# EAGLE schematic Simon (EAGLE 7.6.0)
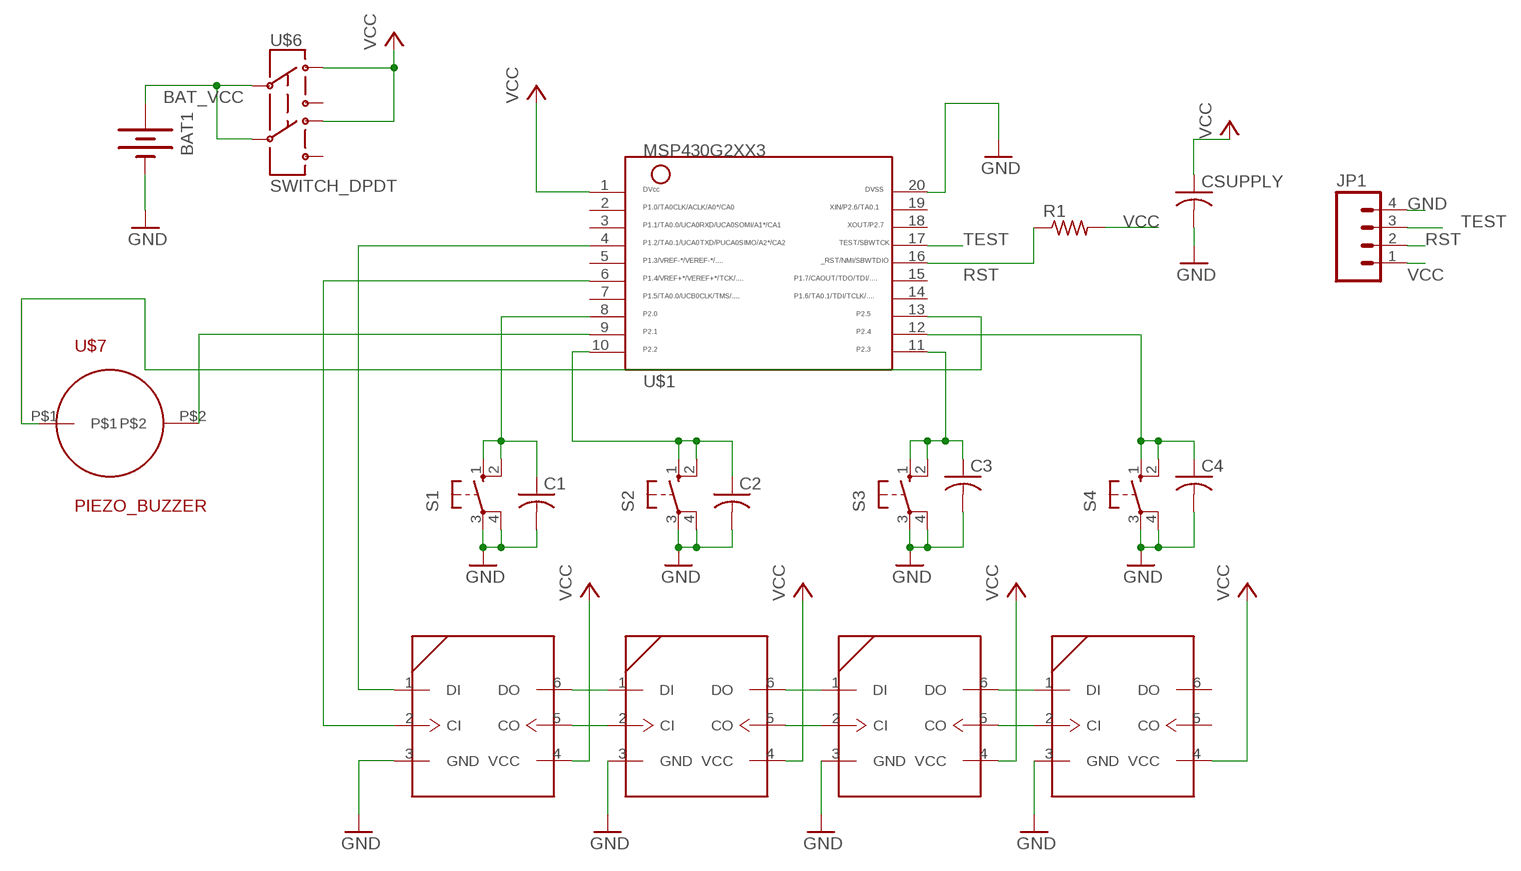
[diagram p0: schematic, sheet 1]

## Parts
BAT1  BATTERY  [BATTERY_PACK_2AA]
C1  C-USC1206  [C1206]
C2  C-USC1206  [C1206]
C3  C-USC1206  [C1206]
C4  C-USC1206  [C1206]
CSUPPLY  C-USC1206  [C1206]
JP1  M04LOCK  [1X04_LOCK]
LED1  APA102  [5050]
LED2  APA102  [5050]
LED3  APA102  [5050]
LED4  APA102  [5050]
R1  R-US_R1206  [R1206]
S1  10-XX  [B3F-10XX]
S2  10-XX  [B3F-10XX]
S3  10-XX  [B3F-10XX]
S4  10-XX  [B3F-10XX]
U$1  MSP430G2XX3TSSOP  [PW20]
U$6  SWITCH_DPDT  [JS_DPDT_TH]
U$7  PIEZO_BUZZER  [PIEZO_BUZZER]

## Nets
BAT_VCC: BAT1.3V(+) U$6.2 U$6.5
GND: BAT1.GND(-) C1.2 C2.2 C3.2 C4.2 CSUPPLY.2 JP1.4 LED1.3(GND) LED2.3(GND) LED3.3(GND) LED4.3(GND) S1.3(P) S1.4(P1) S2.3(P) S2.4(P1) S3.3(P) S3.4(P1) S4.3(P) S4.4(P1) U$1.20
N$1: LED1.6(DO) LED2.1(DI)
N$2: LED1.5(CO) LED2.2(CI)
N$3: LED2.6(DO) LED3.1(DI)
N$4: LED2.5(CO) LED3.2(CI)
N$5: LED3.6(DO) LED4.1(DI)
N$6: LED3.5(CO) LED4.2(CI)
N$7: LED1.1(DI) U$1.4
N$8: LED1.2(CI) U$1.6
N$10: U$1.9 U$7.P$2
N$11: U$1.13 U$7.P$1
N$13: C1.1 S1.1(S) S1.2(S1) U$1.8
N$14: C2.1 S2.1(S) S2.2(S1) U$1.10
N$15: C3.1 S3.1(S) S3.2(S1) U$1.11
N$16: C4.1 S4.1(S) S4.2(S1) U$1.12
RST: JP1.2 R1.1 U$1.16
TEST: JP1.3 U$1.17
VCC: CSUPPLY.1 JP1.1 LED1.4(VCC) LED2.4(VCC) LED3.4(VCC) LED4.4(VCC) R1.2 U$1.1 U$6.1 U$6.4
Unconnected: LED4.5(CO) LED4.6(DO) U$1.2 U$1.3 U$1.5 U$1.7 U$1.14 U$1.15 U$1.18 U$1.19 U$6.3 U$6.6

## Library data of the parts
BAT1 = ELEC327:BATTERY: Battery Holders Various common sizes : AA, AAA, 20mm coin cell and 12mm coin cell. 20MM_4LEGS, BATT-10373
C1-C4 CSUPPLY = rcl:C-US: CAPACITOR, American symbol
JP1 = SparkFun:M04: Header 4 Standard 4-pin 0.1" header. Use with straight break away headers (SKU : PRT-00116), right angle break away headers (PRT-00553), swiss pins (PRT-00743), machine pins (PRT-00117), and female headers (PRT-00115). Molex polarized connector foot print use with SKU : PRT-08231 with associated crimp pins and housings. 1MM SMD Version SKU: PRT-10208
LED1-LED4 = ELEC327:APA102: APA102 SPI RGB LED APA102 is a chainable RGB LED. The control protocol is a variant of SPI.
R1 = resistor:R-US_: RESISTOR, American symbol
S1-S4 = switch-omron:10-XX: OMRON SWITCH; MPN: B3F-1000; OC_FARNELL: 176432; OC_NEWARK: 36M3542
U$1 = ELEC327:MSP430G2XX3: MSP430G2XX3 PDIP (N) 20 Pin Package
U$6 = ELEC327:SWITCH_DPDT
U$7 = ELEC327:PIEZO_BUZZER